# Altium schematic sheet MCU.SchDoc: Багатоканальний пристрій регулювання потужності
size 420 x 297 mm; ApprovedBy: Хоменко М.А.; CheckedBy: Хоменко М.А.; Author: Шокодько Д.А.; CompanyName: НУЧП; DocumentNumber: МРА.ЕН 14194617; Revision: Хоменко М.А.; SheetNumber: 4; SheetTotal: 4; Scale: 1:1; Title2str: електричних нагрівальних елементів; DocumentType: Схема електрична принципова; FirstReferrence: АБВГ.123456.001; T_Contr: Хоменко М.А.; N_Contr: Хоменко М.А.
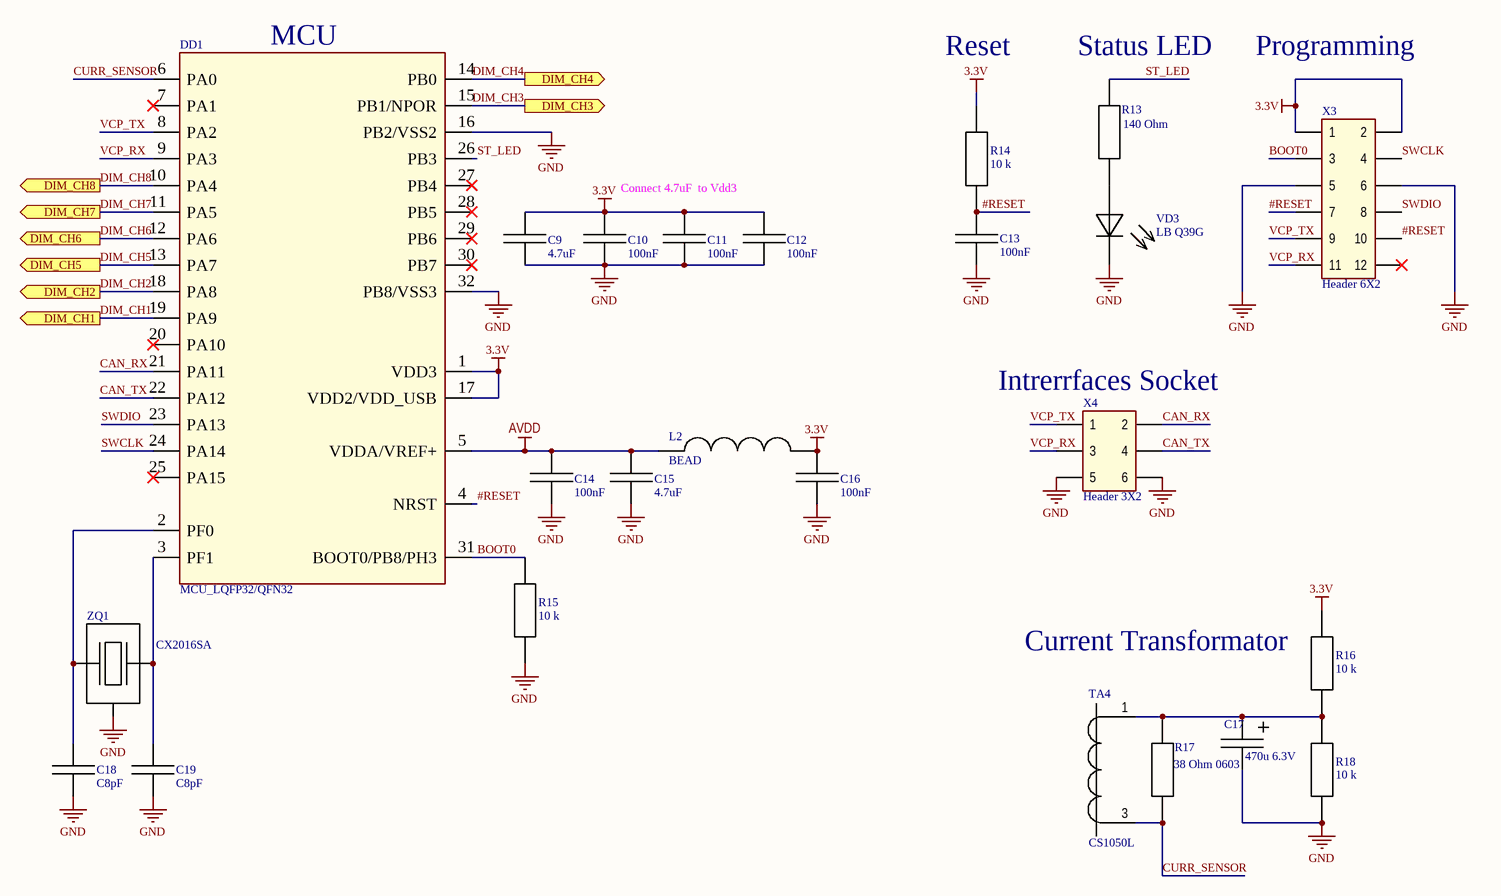
[diagram p0: MCU.SchDoc]

## Parts
C9  4.7uF  [0805C]
C10  100nF  [0603C]
C11  100nF  [0603C]
C12  100nF  [0603C]
C13  100nF  [0603C]
C14  100nF  [0603C]
C15  4.7uF  [0805C]
C16  100nF  [0603C]
C17  470u 6.3V  [C6.3*11-2.5]
C18  C8pF  [C0603]
C19  C8pF  [C0603]
DD1  MCU_LQFP32/QFN32  [LQFP32_0R5_7x7]
L2  BEAD  [0603L]
R13  140 Ohm  [R0603]
R14  10 k  [R0603]
R15  10 k  [R0603]
R16  10 k  [R0603]
R17  38 Ohm 0603  [R0603]
R18  10 k  [R0603]
TA4  CS1050L  [CS1200L]
VD3  LB Q39G  [0603D_G]
X3  Header 6X2  [DIP 2*6]
X4  Header 3X2  [DIP 2*3]
ZQ1  CX2016SA  [XTAL_2SM_3R2X1R5]

## Ports
DIM_CH1 (out), DIM_CH2 (out), DIM_CH3 (out), DIM_CH4 (out), DIM_CH5 (out), DIM_CH6 (out), DIM_CH7 (out), DIM_CH8 (out)

## Nets
3.3V: C9.2 C10.2 C11.2 C12.2 C16.2 DD1.1(VDD3) DD1.17(VDD2/VDD_USB) L2.2 R14.2 R16.2 X3.1 X3.2
AVDD: C14.2 C15.2 DD1.5(VDDA/VREF+) L2.1
GND: C9.1 C10.1 C11.1 C12.1 C13.1 C14.1 C15.1 C16.1 C17.2 C18.1 C19.1 DD1.16(PB2/VSS2) DD1.32(PB8/VSS3) R15.1 R18.1 VD3.2(К) X3.5 X3.6 X4.5 X4.6 ZQ1.2(GND)
#RESET: C13.2 DD1.4(NRST) R14.1 X3.7 X3.10
BOOT0: DD1.31(BOOT0/PB8/PH3) R15.2 X3.3
CAN_RX: DD1.21(PA11) X4.2
CAN_TX: DD1.22(PA12) X4.4
CURR_SENSOR: DD1.6(PA0) R17.1 TA4.3
DIM_CH1: DD1.19(PA9) ; port DIM_CH1
DIM_CH2: DD1.18(PA8) ; port DIM_CH2
DIM_CH3: DD1.15(PB1/NPOR) ; port DIM_CH3
DIM_CH4: DD1.14(PB0) ; port DIM_CH4
DIM_CH5: DD1.13(PA7) ; port DIM_CH5
DIM_CH6: DD1.12(PA6) ; port DIM_CH6
DIM_CH7: DD1.11(PA5) ; port DIM_CH7
DIM_CH8: DD1.10(PA4) ; port DIM_CH8
ST_LED: DD1.26(PB3) R13.2
SWCLK: DD1.24(PA14) X3.4
SWDIO: DD1.23(PA13) X3.8
VCP_RX: DD1.9(PA3) X3.11 X4.3
VCP_TX: DD1.8(PA2) X3.9 X4.1
NetC17_1: C17.1 R16.1 R17.2 R18.2 TA4.1
NetC18_2: C18.2 DD1.2(PF0) ZQ1.1(HOT)
NetC19_2: C19.2 DD1.3(PF1) ZQ1.3(HOT)
NetR13_1: R13.1 VD3.1(А)

Not connected (* = marked no-connect by the designer): DD1 7(PA1)* 20(PA10)* 25(PA15)* 27(PB4)* 28(PB5)* 29(PB6)* 30(PB7)*; X3 12*

## Notes on the sheet
- (near DD1) MCU
- Reset
- (near R13) Status LED
- Programming
- Connect 4.7uF  to Vdd3
- (near X4) Intrerrfaces Socket
- (near R16) Current Transformator
- Перше використання
- Довідн. №
- Підп. і дата
- Інв. № дубл.
- Взамін інв. №
- Розроб.
- Зм.
- Лист
- № докум.
- Підп.
- Дата
- Літ.
- Маса
- Масштаб
- Перевір.
- Т.контр.
- Листів
- Інв. № оригін.
- Затв.
- Н.контр.
- 2.106-A3
- Формат А3

## Library data of the parts
C9 C15 = 4.7uF: Capasitor 0805
C10-C14 C16 = 100nF: Capasitor 0603
C17 = 470u 6.3V: Capasitor
C18 C19 = C8pF: Capasitor 0603
DD1 = MCU_LQFP32: STM32F0
L2 = Inductor: Value: 100uH; Published: 8-Jun-2000; Revision: July-2002: Re-released for DXP Platform.; Publisher: Altium Limited
R13 = 140 Ohm: Resistor 0603
R14-R16 R18 = 10 k: Resistor 0603
R17 = 38 Ohm: Resistor
VD3 = GREEN_LED: Status Led
X4 = Header 3X2: Header 6X2
ZQ1 = CRYSTAL_32MHZ: Crystal CX2016SA